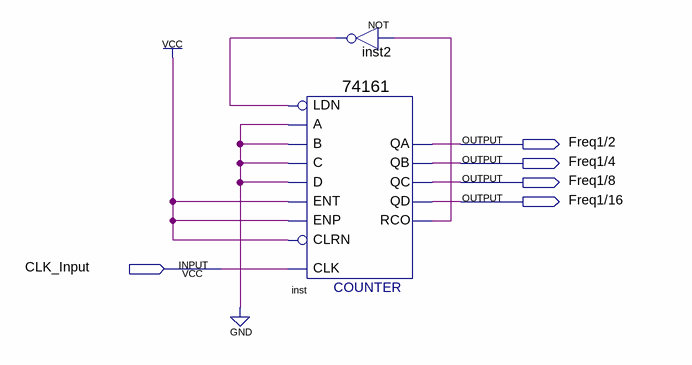
[diagram p0: schematic sheet]
// Quartus schematic FreqDiv16.bdf as structural Verilog: 2 symbols, 5 pins
module FreqDiv16 (
  input  CLK_Input,
  output \Freq1/2 ,
  output \Freq1/4 ,
  output \Freq1/8 ,
  output \Freq1/16 
);

  wire inst2_out, inst_rco;

  not inst2 (inst2_out, inst_rco);
  \74161  inst (
    .CLRN(1'b1), .CLK(CLK_Input), .ENP(1'b1), .LDN(inst2_out), .A(1'b0), .D(1'b0), .ENT(1'b1), .B(1'b0),
    .C(1'b0), .QD(\Freq1/16 ), .QC(\Freq1/8 ), .QB(\Freq1/4 ), .QA(\Freq1/2 ), .RCO(inst_rco));
endmodule
